# EasyEDA Pro project APT32F103.eprj

# Schematic APT32F103
Board Name: APT32F103; Create Date: 2025-05-16; Page Name: core; Project Name: APT32F103; Schematic Name: APT32F103; Update Date: 2025-05-17; Company: 嘉立创EDA; Page Size: A4; Version: V1.0
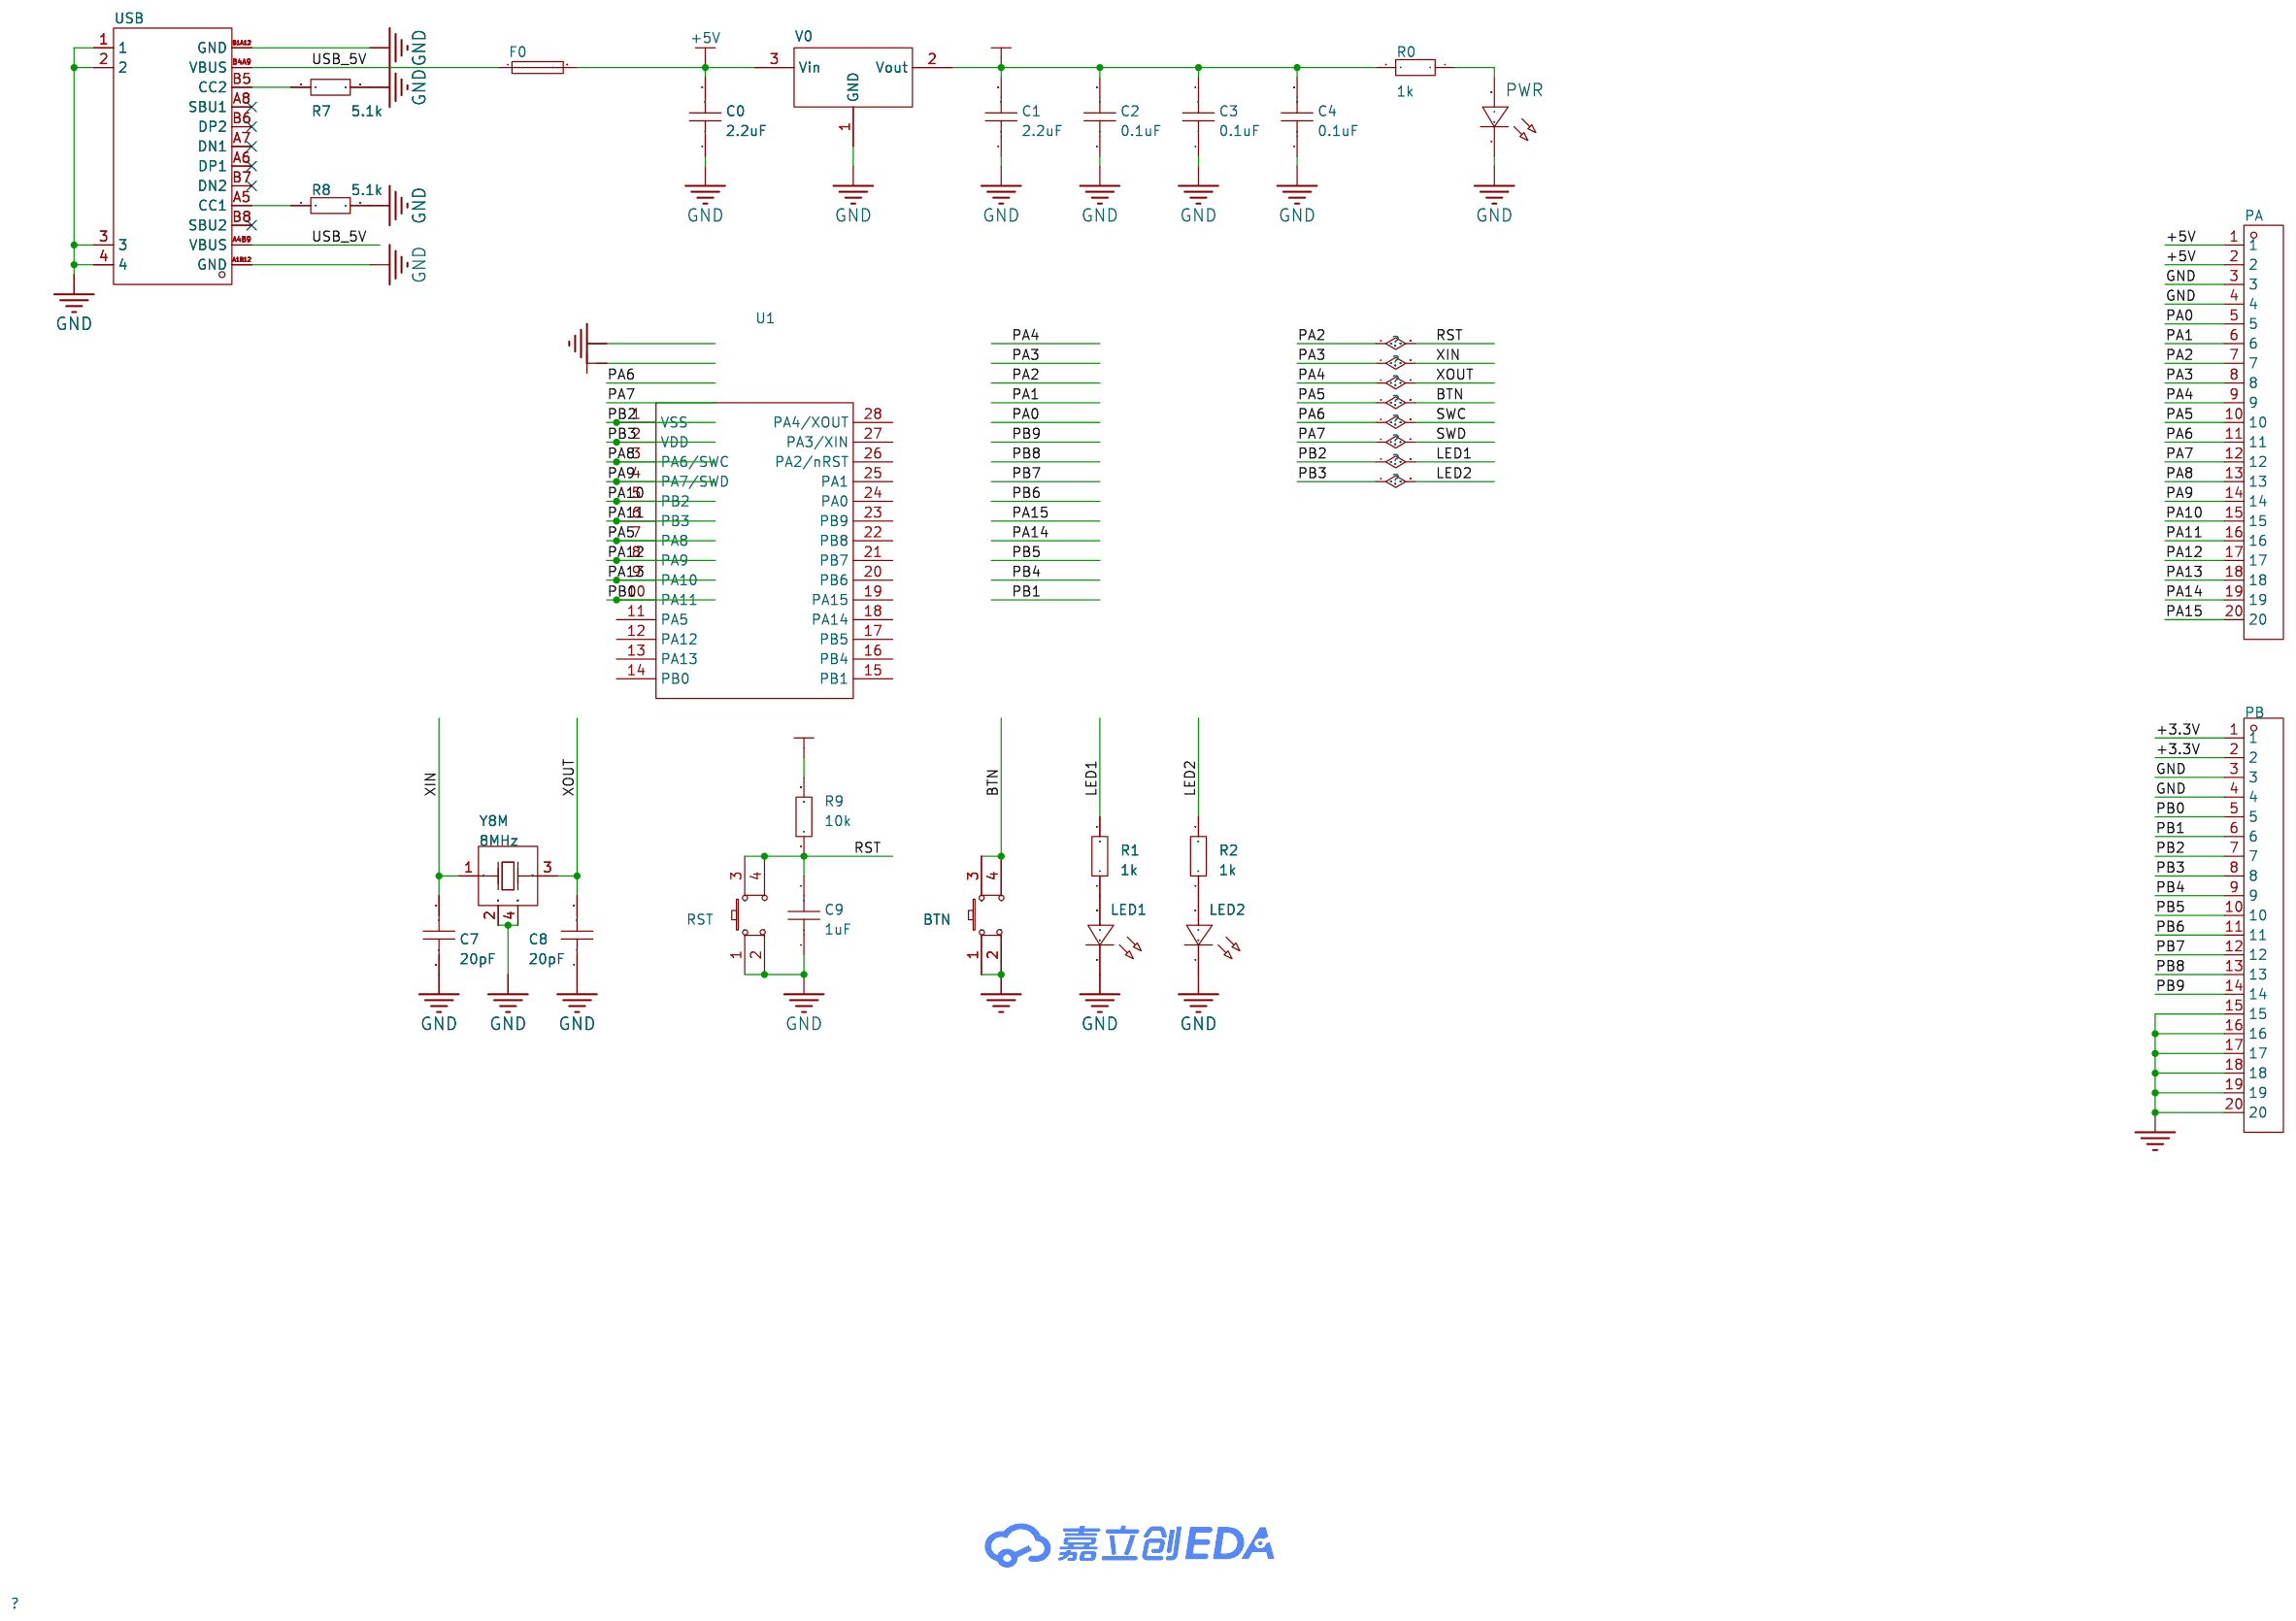
[diagram p0: schematic sheet]

## Parts
BTN  PTS815SJK250SMTRLFS  [SW-SMD_4P-L4.2-W3.3-P2.15-LS5.1]
C0  2.2uF  [C0603]
C1  2.2uF  [C0603]
C2  0.1uF  [C0603]
C3  0.1uF  [C0603]
C4  0.1uF  [C0603]
C7  20pF  [C0603]
C8  20pF  [C0603]
C9  1uF  [C0603]
F0  JK-nSMD100-16  [F1206]
LED1  -  [LED0603-RD_BLUE]
LED2  -  [LED0603-RD_BLUE]
PA  -  [HDR-TH_20P-P2.54-V-M-1]
PB  -  [HDR-TH_20P-P2.54-V-M-1]
PWR  -  [LED0603-RD_BLUE]
R0  1k  [R0603]
R1  1k  [R0603]
R2  1k  [R0603]
R7  5.1k  [R0603]
R8  5.1k  [R0603]
R9  10k  [R0603]
RST  PTS815SJK250SMTRLFS  [SW-SMD_4P-L4.2-W3.3-P2.15-LS5.1]
U1  -  [SOP-28_L17.9-W7.5-P1.27-LS10.3-BL]
USB  USB-TYPE-C-017  [USB-TYPE-C-SMD_C9900008089]
V0  AMS1117-3.3  [SOT-89-3_L4.5-W2.5-P1.50-LS4.2-BR]
Y8M  8MHz  [OSC-SMD_4P-L3.2-W2.5-BL]

## Library data of the parts
BTN RST = PTS815SJK250SMTRLFS: 操作寿命10万次，使用温度-20°C 至 70°C,尺寸4.20mmx3.20mmx2.50mm，操作力度2.5N; LCSC Part Name: 轻触开关; Supplier Part: C918859; Manufacturer: CK; Supplier Footprint: SMD; JLCPCB Part Class: 扩展库; Datasheet: https://atta.szlcsc.com/upload/public/pdf/source/20190916/C411883_4F77F16E1D8E48DC707D8949CEE7CF80.pdf; Supplier: LCSC
C0-C4 C7-C9 = CAP_0603: 容值:100nF;精度:±10%;额定电压:50V;温度系数:X7R;; Supplier Footprint: 0603
F0 = JK-nSMD100-16: 耐压:16V;最大电流:100A;保持电流(Ih):1A;跳闸电流:1.8A;; LCSC Part Name: 16V 1A 1206自恢复; Supplier Part: C369161; Manufacturer: JK(金科); Supplier Footprint: 1206; JLCPCB Part Class: 扩展库; Datasheet: https://atta.szlcsc.com/upload/public/pdf/source/20190807/C409806_27B0F7EFFA3D5CEE60CCD1EE0A933E0A.pdf; Supplier: LCSC; Voltage - Max: 16V; Current - Max: 100A; Hold Current: 1A; Trip Current: 1.8A; Time to Trip(Max): 300ms
LED1 LED2 = LED_0603-B: 照明颜色:蓝色;主波长/色坐标:465~475nm;; Supplier Footprint: 0603; Supplier Part: C72041
PA PB = HDR-M_2.54_1x20P: 间距:2.54mm;总PIN位数:20;排数:1;插针结构:-;行距:-;安装类型:直插;圆针/方针:-;额定电流:-;额定电压:-;配合针长度:-;塑高:-;触头材质:黄铜;触头镀层:-;颜色:黑色;; Supplier Part: C50981; Supplier Footprint: 插件
PWR = LED_0603-R: 发光颜色:红灯;二极管配置:-;透镜颜色:无色透明;主波长:617.5nm;峰值波长:632nm;色温:-;光通量(25时):-;测试电流:5mA;正向电压(VF):2.2V;发光强度:28.5mcd;功率:60mW;发光角度:120°;安装方式:-;工作温度:-40~+85;; Supplier Footprint: 0603; Supplier Part: C72044
R0-R2 R7-R9 = Res_0603: Supplier Footprint: 0603
U1 = APT32F1031G9M6
USB = USB-TYPE-C-017: 连接器类型:Type-C;标准:-;公母:母座;触点数量:16;端口数量:1;安装方式:卧贴;额定电流 - 电源:3A;工作温度范围:-25~+85;; Supplier Part: C2927037; Manufacturer: DEALON(德艺隆); Supplier Footprint: SMD; JLCPCB Part Class: 扩展库; Datasheet: https://atta.szlcsc.com/upload/public/pdf/source/20211217/653222EE5174722C9DFE2966329956D8.pdf; Supplier: LCSC; Connector Type: Type-C; Gender: 母座; Number of Contacts: 16; Number of Ports: 1; Mounting Style: 卧贴; Current Rating - Power (Max): 3A; Operating Temperature Range: -25~+85
V0 = AMS1117-3.3_SOT-89: 输出类型:-;; Supplier Part: C880752; Manufacturer: Slkor(萨科微); Supplier Footprint: SOT-89-3; JLCPCB Part Class: 扩展库; Datasheet: https://atta.szlcsc.com/upload/public/pdf/source/20201231/C426566_7F22DB93439D00F3FA27143E4F28C6AA.pdf; Supplier: LCSC
Y8M = X322512MSB4SI: 晶振类型:贴片无源晶振;频率:12MHz;频率公差:±10ppm;频率稳定度:±30ppm;负载电容:20pF;工作温度:-40~+85;; LCSC Part Name: 12MHz ±10ppm 20pF; Supplier Part: C9002; Manufacturer: YXC(扬兴晶振); Supplier Footprint: SMD3225-4P; JLCPCB Part Class: 基础库; Datasheet: https://atta.szlcsc.com/upload/public/pdf/source/20210329/C112971_1F611BDC486E193C1706F6D8EB5AA189.pdf; Supplier: LCSC; Crystal Type: 贴片无源晶振; Frequency Tolerance: ±10ppm; Frequency Stability: ±30ppm; Load Capacitance: 20pF; Operating Temperature: -40~+85

## Nets
+3.3V: C1.2 C2.2 C3.2 C4.2 PB.1 PB.2 R0.2 R9.2 V0.2(Vout)
+5V: C0.2 F0.2 PA.1 PA.2 V0.3(Vin)
GND: BTN.1 BTN.2 C0.1 C1.1 C2.1 C3.1 C4.1 C7.2 C8.1 C9.1 LED1.1(C) LED2.1(C) PA.3 PA.4 PB.3 PB.4 PB.15 PB.16 PB.17 PB.18 PB.19 PB.20 PWR.1(C) R7.2 R8.2 RST.1 RST.2 USB.1 USB.2 USB.3 USB.4 USB.A1B12(GND) USB.B1A12(GND) V0.1(GND) Y8M.2(GND) Y8M.4(GND)
BTN: BTN.3 BTN.4 PA.10 U1.7(PA8)
LED1: PB.7 R1.2 U1.1(VSS)
LED2: PB.8 R2.2 U1.2(VDD)
PA0: PA.5
PA1: PA.6
PA2: C9.2 PA.7 R9.1 RST.3 RST.4
PA3: C7.1 PA.8 Y8M.1(OSC1)
PA4: C8.2 PA.9 Y8M.3(OSC2)
PA6: PA.11
PA7: PA.12
PA8: PA.13 U1.3(PA6/SWC)
PA9: PA.14 U1.4(PA7/SWD)
PA10: PA.15 U1.5(PB2)
PA11: PA.16 U1.6(PB3)
PA12: PA.17 U1.8(PA9)
PA13: PA.18 U1.9(PA10)
PA14: PA.19
PA15: PA.20
PB0: PB.5 U1.10(PA11)
PB1: PB.6
PB4: PB.9
PB5: PB.10
PB6: PB.11
PB7: PB.12
PB8: PB.13
PB9: PB.14
USB_5V: F0.1 USB.A4B9(VBUS) USB.B4A9(VBUS)
$1N2394: R8.1 USB.A5(CC1)
$1N2395: R7.1 USB.B5(CC2)
$1N2407: PWR.2(A) R0.1
$1N2634: LED2.2(A) R2.1
$1N2724: LED1.2(A) R1.1

Not connected (* = marked no-connect by the designer): U1 11(PA5) 12(PA12) 13(PA13) 14(PB0) 15(PB1) 16(PB4) 17(PB5) 18(PA14) 19(PA15) 20(PB6) 21(PB7) 22(PB8) 23(PB9) 24(PA0) 25(PA1) 26(PA2/nRST) 27(PA3/XIN) 28(PA4/XOUT); USB A6(DP1)* A7(DN1)* A8(SBU1)* B6(DP2)* B7(DN2)* B8(SBU2)*

# Board APT32F103
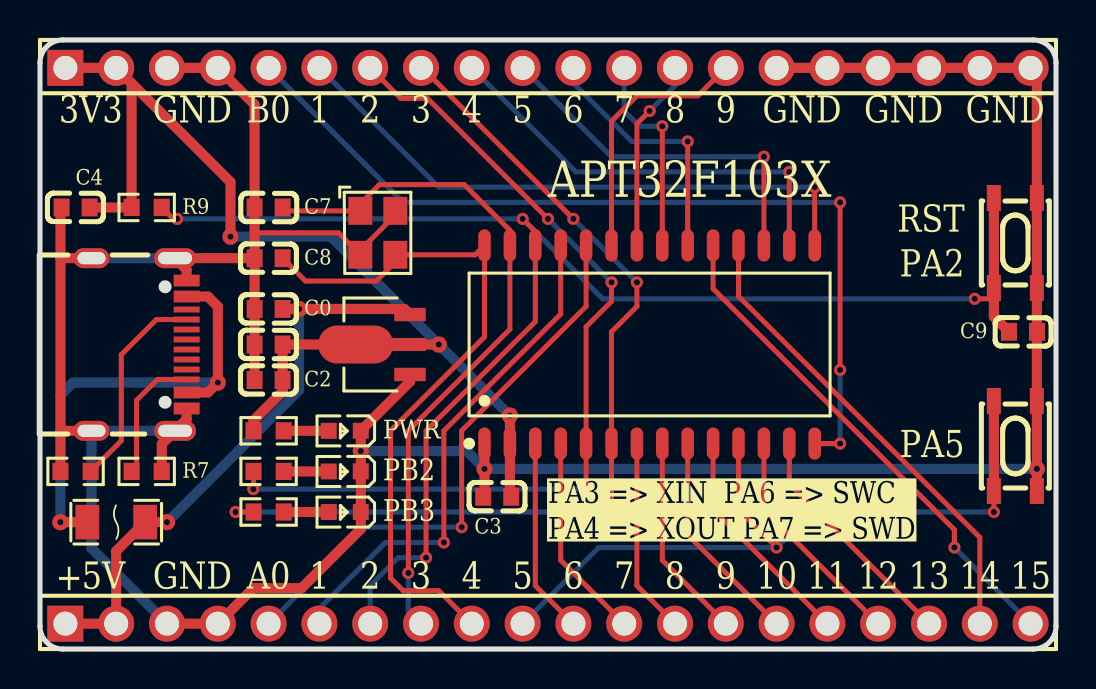
[diagram p1: board, top side]
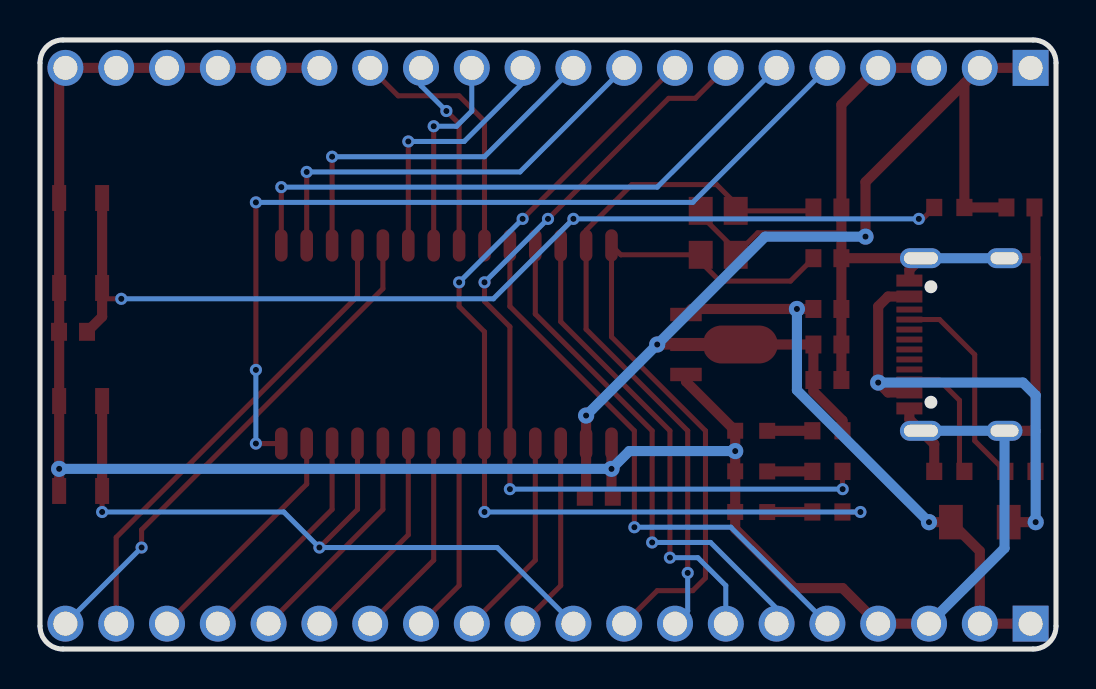
[diagram p2: board, bottom side, seen from below]

Outline 50.8 x 30.48 mm; copper layers: Top Layer, Bottom Layer. Coordinates in mm from the lower left corner of the outline.
Outline path: 0,29.34 0,1.14 arc(0.33,0.33) 1.14,0 49.66,0 arc(50.47,0.33) 50.8,1.14 50.8,29.34 arc(50.47,30.15) 49.66,30.48 1.14,30.48 arc(0.33,30.15) 0,29.34
Stack: Top Layer 0.035mm / Dielectric1 1.51mm FR4 er 4.5 / Bottom Layer 0.035mm

## Design rules (mm)
template: JLCPCB Capability(Two Layers Board)
spacing copperThickness1oz (default): track to track 0.102, other pairs 0.152 to 0.3
spacing copperThickness2oz: track to track 0.203, other pairs 0.152 to 0.3
track width copperThickness1oz (default): min 0.127, default 0.254, max 2.54
track width copperThickness2oz: min 0.203, default 0.254, max 2.54
differential pair differentialPair (default): width min 0.127, default 0.254, max 2.54; gap min 0.152, default 0.152
via viaSize (default): diameter min 0.5, default 0.61, max 10; hole min 0.3, default 0.305, max 6.3

## Placement (name value [footprint] x y rotation side)
BTN  PTS815SJK250SMTRLFS  [SW-SMD_4P-L4.2-W3.3-P2.15-LS5.1]  48.77 10.16 270 top
C0  2.2uF  [C0603]  11.43 17.02 0 top
C1  2.2uF  [C0603]  11.43 15.24 0 top
C2  0.1uF  [C0603]  11.43 13.46 0 top
C3  0.1uF  [C0603]  22.86 7.62 0 top
C4  0.1uF  [C0603]  1.78 22.1 0 top
C7  20pF  [C0603]  11.43 22.1 180 top
C8  20pF  [C0603]  11.43 19.56 0 top
C9  1uF  [C0603]  49.15 15.88 180 top
F0  JK-nSMD100-16  [F1206]  3.81 6.35 0 top
LED1  -  [LED0603-RD_BLUE]  15.24 8.89 180 top
LED2  -  [LED0603-RD_BLUE]  15.24 6.86 180 top
PA  -  [HDR-TH_20P-P2.54-V-M-1]  25.4 1.27 0 top
PB  -  [HDR-TH_20P-P2.54-V-M-1]  25.4 29.08 0 top
PWR  -  [LED0603-RD_BLUE]  15.24 10.92 180 top
R0  1k  [R0603]  11.43 10.92 180 top
R1  1k  [R0603]  11.43 8.89 180 top
R2  1k  [R0603]  11.43 6.86 180 top
R7  5.1k  [R0603]  5.33 8.89 0 top
R8  5.1k  [R0603]  1.78 8.89 180 top
R9  10k  [R0603]  5.33 22.1 180 top
RST  PTS815SJK250SMTRLFS  [SW-SMD_4P-L4.2-W3.3-P2.15-LS5.1]  48.77 20.32 270 top
U1  -  [SOP-28_L17.9-W7.5-P1.27-LS10.3-BL]  30.48 15.24 0 top
USB  USB-TYPE-C-017  [USB-TYPE-C-SMD_C9900008089]  4.95 15.24 270 top
V0  AMS1117-3.3  [SOT-89-3_L4.5-W2.5-P1.50-LS4.2-BR]  17.15 15.24 0 top
Y8M  8MHz  [OSC-SMD_4P-L3.2-W2.5-BL]  16.89 20.83 270 top

## Footprints (pads in the part's own frame, mm; a bottom-side part is the same pattern mirrored in y, then rotated)
C0603
  rect 0.8x0.9 smd: 1(-0.7,0) 2(0.7,0)
F1206
  rect 1.19x1.728 smd: 1(-1.445,0) 2(1.445,0)
HDR-TH_20P-P2.54-V-M-1
  rect 1.801x1.801 hole 1.199: 1(-24.13,0)
  round 1.801 hole 1.199: 2(-21.59,0) 3(-19.05,0) 4(-16.51,0) 5(-13.97,0) 6(-11.43,0) 7(-8.89,0) 8(-6.35,0) 9(-3.81,0) 10(-1.27,0) 11(1.27,0) 12(3.81,0) 13(6.35,0) 14(8.89,0) 15(11.43,0) 16(13.97,0) 17(16.51,0) 18(19.05,0) 19(21.59,0) 20(24.13,0)
LED0603-RD_BLUE
  rect 0.8x0.8 smd: 1(-0.8,-0.003) 2(0.8,0.003)
OSC-SMD_4P-L3.2-W2.5-BL
  rect 1.4x1.2 smd: 1(-1.1,-0.875) 2(1.1,-0.875) 3(1.1,0.875) 4(-1.1,0.875)
R0603
  rect 0.806x0.864 smd: 1(-0.753,0) 2(0.753,0)
SOP-28_L17.9-W7.5-P1.27-LS10.3-BL
  oval 0.63x1.615 smd: 1(-8.255,-4.957) 2(-6.985,-4.957) 3(-5.715,-4.957) 4(-4.445,-4.957) 5(-3.175,-4.957) 6(-1.905,-4.957) 7(-0.635,-4.957) 8(0.635,-4.957) 9(1.905,-4.957) 10(3.175,-4.957) 11(4.445,-4.957) 12(5.715,-4.957) 13(6.985,-4.957) 14(8.255,-4.957) 15(8.255,4.957) 16(6.985,4.957) 17(5.715,4.957) 18(4.445,4.957) 19(3.175,4.957) 20(1.905,4.957) 21(0.635,4.957) 22(-0.635,4.957) 23(-1.905,4.957) 24(-3.175,4.957) 25(-4.445,4.957) 26(-5.715,4.957) 27(-6.985,4.957) 28(-8.255,4.957)
SOT-89-3_L4.5-W2.5-P1.50-LS4.2-BR
  rect 1.575x0.672 smd: 1(1.356,-1.5) 3(1.356,1.5)
  custom 5.377x1.9 smd: 2(-1.356,0)
SW-SMD_4P-L4.2-W3.3-P2.15-LS5.1
  rect 1.3x0.701 smd: 1(-2.251,1.075) 2(2.251,1.075) 3(-2.251,-1.075) 4(2.251,-1.075)
USB-TYPE-C-SMD_C9900008089
  oval 1x2.1 hole 0.6x1.7: 1(-4.32,1.801) 2(4.32,1.801)
  oval 1x1.8 hole 0.6x1.4: 3(-4.32,-2.379) 4(4.32,-2.379)
  rect 0.6x1.3 smd: A1B12(-3.2,2.379) A4B9(-2.4,2.379) B1A12(3.2,2.379) B4A9(2.4,2.379)
  rect 0.3x1.3 smd: A5(-1.25,2.379) A6(-0.25,2.379) A7(0.25,2.379) A8(1.25,2.379) B5(1.75,2.379) B6(0.75,2.379) B7(-0.75,2.379) B8(-1.75,2.379)

## Nets
+3.3V: C1.2 C2.2 C3.2 C4.2 PB.1 PB.2 R0.2 R9.2 U1.2 V0.2
+5V: C0.2 F0.2 PA.1 PA.2 V0.3
GND: BTN.1 BTN.2 C0.1 C1.1 C2.1 C3.1 C4.1 C7.2 C8.1 C9.1 LED1.1 LED2.1 PA.3 PA.4 PB.3 PB.4 PB.15 PB.16 PB.17 PB.18 PB.19 PB.20 PWR.1 R7.2 R8.2 RST.1 RST.2 U1.1 USB.1 USB.2 USB.3 USB.4 USB.A1B12 USB.B1A12 V0.1 Y8M.2 Y8M.4
BTN: BTN.3 BTN.4 PA.10 U1.11
LED1: PB.7 R1.2 U1.5
LED2: PB.8 R2.2 U1.6
PA0: PA.5 U1.24
PA1: PA.6 U1.25
PA2: C9.2 PA.7 R9.1 RST.3 RST.4 U1.26
PA3: C7.1 PA.8 U1.27 Y8M.1
PA4: C8.2 PA.9 U1.28 Y8M.3
PA6: PA.11 U1.3
PA7: PA.12 U1.4
PA8: PA.13 U1.7
PA9: PA.14 U1.8
PA10: PA.15 U1.9
PA11: PA.16 U1.10
PA12: PA.17 U1.12
PA13: PA.18 U1.13
PA14: PA.19 U1.18
PA15: PA.20 U1.19
PB0: PB.5 U1.14
PB1: PB.6 U1.15
PB4: PB.9 U1.16
PB5: PB.10 U1.17
PB6: PB.11 U1.20
PB7: PB.12 U1.21
PB8: PB.13 U1.22
PB9: PB.14 U1.23
USB_5V: F0.1 USB.A4B9 USB.B4A9
$1N2394: R8.1 USB.A5
$1N2395: R7.1 USB.B5
$1N2407: PWR.2 R0.1
$1N2634: LED2.2 R2.1
$1N2724: LED1.2 R1.1

Pads without a net: USB A6 A7 A8 B6 B7 B8

## Via types
v1: diameter 0.813, hole 0.305, Top Layer to Bottom Layer, 10 vias
v2: diameter 0.61, hole 0.305, Top Layer to Bottom Layer, 27 vias

## Routing (per net, layer and track width the routed paths; a pad name or vN(x,y) marks a point on that pad's centre or on a via; arc(x,y) is an arc through that point)
+3.3V: length 56.2
  Top Layer w0.508: v1(23.5,11.68) 23.5,7.69 C3.2 ; PB.1 PB.2 4.58,28.31 ; C4.2 R9.2 4.58,28.31 ; 4.58,28.31 9.53,23.37 v1(9.53,20.64) ; v1(19.94,15.24) C1.2 C2.2 12.13,12.89 10.68,11.44 R0.2
  Bottom Layer w0.508: v1(23.5,11.68) v1(19.94,15.24) 14.54,20.64 v1(9.53,20.64)
+5V: length 29.2
  Top Layer w0.508: C0.2 18.22,17.02 V0.3 ; v1(6.35,6.35) F0.2 3.81,4.91 PA.2 PA.1
  Bottom Layer w0.508: v1(6.35,6.35) 12.95,12.95 v1(12.95,17.02)
GND: length 163.8
  Top Layer w0.254: 10.73,20.83 14.92,20.83 Y8M.2 16.02,19.97 17.77,21.72 Y8M.4
  Top Layer w0.508: USB.A1B12 7.33,18.98 USB.1 10.73,19.56 C8.1 ; V0.1 18.5,13.39 PWR.1 LED1.1 LED2.1 16.04,6.01 13.08,3.05 10.67,3.05 PA.4 PA.3 ; C8.1 C0.1 C1.1 C2.1 ; C8.1 C7.2 10.73,27.24 PB.4 PB.3 ; R7.2 6.09,10.25 USB.2 7.33,11.5 USB.B1A12 ; 1.02,10.92 1.02,19.56 ; 1.02,10.92 R8.2 ; 1.02,10.92 USB.4 ; 1.02,19.56 1.02,22.04 C4.1 ; 1.02,19.56 USB.3 ; C3.1 22.22,7.69 v1(22.22,9.02) U1.1 ; BTN.2 BTN.1 RST.2 RST.1 49.84,28.77 PB.20 PB.19 PB.18 PB.17 PB.16 PB.15
  Bottom Layer w0.508: USB.3 USB.1 ; PA.3 2.57,5.05 USB.4 USB.2 ; v1(16.04,9.91) 21.34,9.91 v1(22.22,9.02) v1(49.84,9.02)
BTN: length 37.4
  Top Layer w0.254: BTN.4 v2(47.69,6.86) ; U1.11 34.93,6.98 v2(36.83,5.08)
  Top Layer w0.508: BTN.3 BTN.4
  Bottom Layer w0.254: v2(47.69,6.86) 38.61,6.86 v2(36.83,5.08) 27.94,5.08 PA.10
LED1: length 44.9
  Top Layer w0.254: v2(27.31,8) U1.5 27.31,16.13 28.57,17.4 v2(28.57,18.35) ; v2(25.4,21.53) 19.37,27.56 18.03,27.56 PB.7 ; v2(10.67,8) 10.68,8.01 R1.2
  Bottom Layer w0.254: v2(25.4,21.53) v2(28.57,18.35) ; v2(10.67,8) v2(27.31,8)
LED2: length 47
  Top Layer w0.254: v2(26.67,21.53) 19.11,29.08 PB.8 ; v2(29.84,18.35) 29.84,17.14 28.57,15.88 U1.6 v2(28.57,6.86) ; R2.2 v2(9.78,6.86)
  Bottom Layer w0.254: v2(26.67,21.53) v2(29.84,18.35) ; v2(9.78,6.86) v2(28.57,6.86)
PA0: length 28.3
  Top Layer w0.254: v2(21.08,6.1) 21.08,10.92 27.31,17.14 U1.24
  Bottom Layer w0.254: PA.5 16.26,6.1 v2(21.08,6.1)
PA1: length 25.6
  Top Layer w0.254: v2(20.19,5.33) 20.19,10.92 26.03,16.76 U1.25
  Bottom Layer w0.254: PA.6 13.97,2.03 17.27,5.33 v2(20.19,5.33)
PA2: length 75.3
  Top Layer w0.254: R9.1 6.66,21.53 v2(6.86,21.53) ; v2(24.13,21.53) 24.76,20.89 U1.26 24.76,16.38 19.3,10.92 v2(19.3,4.57) ; 47.69,17.54 47.68,17.53 v2(46.74,17.53)
  Top Layer w0.508: C9.2 47.69,16.63 RST.4 RST.3
  Bottom Layer w0.254: v2(6.86,21.53) v2(24.13,21.53) 28.13,17.53 v2(46.74,17.53) ; PA.7 16.51,3.17 17.91,4.57 v2(19.3,4.57)
PA3: length 35.2
  Top Layer w0.254: C7.1 12.3,21.93 Y8M.1 16.02,22.29 16.97,23.24 21.21,23.24 23.5,20.95 23.5,16 18.41,10.92 v2(18.41,3.81)
  Bottom Layer w0.254: PA.8 18.41,1.91 v2(18.41,3.81)
PA4: length 35.1
  Top Layer w0.254: PA.9 19.94,2.92 18.16,2.92 17.53,3.56 17.53,10.92 22.22,15.62 U1.28 21.76,19.73 Y8M.3 17.77,19.37 16.81,18.42 13.27,18.42 C8.2
PA6: length 9.8
  Top Layer w0.254: U1.3 24.76,3.17 PA.11
PA7: length 10.3
  Top Layer w0.254: U1.4 26.03,4.44 PA.12
PA8: length 9.8
  Top Layer w0.254: U1.7 29.84,3.17 PA.13
PA9: length 10.3
  Top Layer w0.254: PA.14 31.12,4.44 31.12,10.28
PA10: length 10.9
  Top Layer w0.254: U1.9 32.38,5.72 PA.15
PA11: length 11.4
  Top Layer w0.254: U1.10 33.66,6.98 PA.16
PA12: length 11.4
  Top Layer w0.254: U1.12 36.19,6.98 PA.17
PA13: length 11.9
  Top Layer w0.254: U1.13 37.47,8.25 PA.18
PA14: length 23.9
  Top Layer w0.254: PA.19 46.99,5.59 34.93,17.65 U1.18
PA15: length 25.5
  Top Layer w0.254: v2(45.72,5.08) 45.72,5.97 33.66,18.03 U1.19
  Bottom Layer w0.254: v2(45.72,5.08) PA.20
PB0: length 44.7
  Top Layer w0.254: 38.74,10.28 v2(40,10.28) ; v2(40,13.97) v2(40,22.35)
  Bottom Layer w0.254: PB.5 18.16,22.35 v2(40,22.35) ; v2(40,10.28) v2(40,13.97)
PB1: length 30.2
  Top Layer w0.254: 38.74,20.2 v2(38.74,23.11)
  Bottom Layer w0.254: v2(38.74,23.11) 19.94,23.11 PB.6
PB4: length 21.7
  Top Layer w0.254: U1.16 v2(37.47,23.88)
  Bottom Layer w0.254: v2(37.47,23.88) 26.8,23.88 PB.9
PB5: length 18.3
  Top Layer w0.254: U1.17 v2(36.19,24.64)
  Bottom Layer w0.254: v2(36.19,24.64) 28.57,24.64 PB.10
PB6: length 12.9
  Top Layer w0.254: U1.20 v2(32.38,25.4)
  Bottom Layer w0.254: v2(32.38,25.4) 29.59,25.4 26.67,28.32 PB.11
PB7: length 10.3
  Top Layer w0.254: 31.12,20.2 v2(31.12,26.16)
  Bottom Layer w0.254: v2(31.12,26.16) 29.97,26.16 29.21,26.92 PB.12
PB8: length 9.7
  Top Layer w0.254: v2(30.48,26.92) 29.84,26.29 U1.22
  Bottom Layer w0.254: v2(30.48,26.92) 31.75,28.19 PB.13
PB9: length 13
  Top Layer w0.254: PB.14 32.89,27.69 29.84,27.69 28.57,26.42 U1.23
USB_5V: length 23.2
  Top Layer w0.508: v1(1.02,6.35) 2.36,6.35 ; USB.B4A9 8.4,12.84 v1(8.89,13.33) 8.89,17.14 8.4,17.64 USB.A4B9
  Bottom Layer w0.508: v1(1.02,6.35) 1.02,12.7 1.65,13.33 v1(8.89,13.33)
$1N2394: length 10.5
  Top Layer w0.254: R8.1 4.06,10.42 4.06,14.73 5.82,16.49 USB.A5
$1N2395: length 6.6
  Top Layer w0.254: USB.B5 5.87,13.49 4.83,12.45 4.83,9.14 R7.1
$1N2407: length 2.3
  Top Layer w0.508: PWR.2 14.44,10.92 R0.1
$1N2634: length 2.3
  Top Layer w0.508: LED2.2 14.44,6.86 R2.1
$1N2724: length 2.3
  Top Layer w0.508: R1.1 14.44,8.89 LED1.2

## Text on the board
Top Silkscreen Layer: PB2 | PB3 | PA3 => XIN  PA6 => SWC / PA4 => XOUT PA7 => SWD | 3V3 | GND | B0 | 1 | 2 | 3 | 4 | 5 | 6 | 7 | 8 | 9 | +5V | A0 | 10 | 11 | 12 | 13 | 14 | 15 | RST / PA2 | PA5 | APT32F103X
